# EAGLE design Enclosure 100x68 PBC-X (EAGLE 9.6.1)
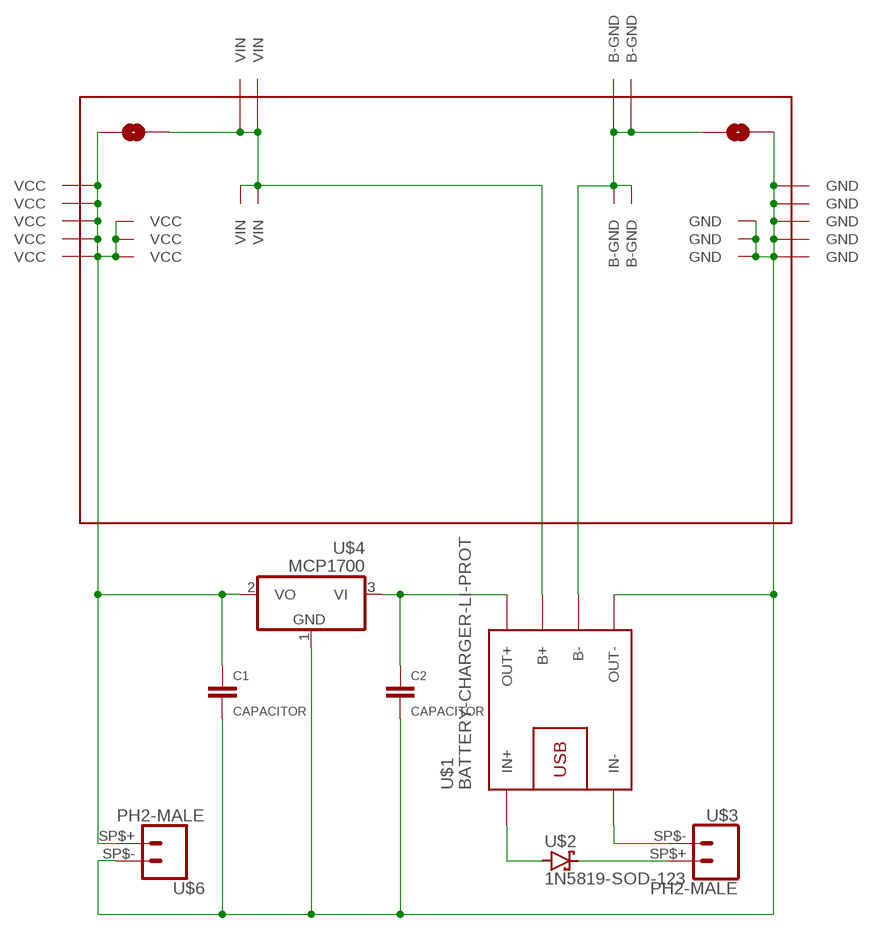
[diagram p0: schematic, sheet 1]

## Parts
C1  CAPACITOR  [C0805]
C2  CAPACITOR  [C0805]
U$1  BATTERY-CHARGER-LI-PROT  [BATTERY-CHARGER-LI-PROT]
U$2  1N5819-SOD-123  [SOD-123]
U$3  PH2-MALE  [PH2]
U$4  MCP1700  [SOT23]
U$5  PROTO-34X22-BAT-SJ-CHG  [PROTO-34X22-BAT-SJ-CHG]
U$6  PH2-MALE  [PH2]

## Nets
GND: C1.2 C2.2 U$1.OUT- U$4.1(GND) U$5.GND U$5.P33-13(GND) U$5.P33-14(GND) U$5.P33-15(GND) U$5.P34-13(GND) U$5.P34-14(GND) U$5.P34-15(GND) U$5.P34-16(GND) U$5.P34-17(GND) U$6.SP$-
N$1: U$2.2(C) U$3.SP$+
N$2: U$1.IN- U$3.SP$-
N$3: U$1.B+ U$5.P02-17(VIN) U$5.P03-16(VIN) U$5.P05-19(VIN) U$5.P06-19(VIN) U$5.VIN
N$4: U$1.B- U$5.B-GND U$5.P28-19(B-GND) U$5.P30-19(B-GND) U$5.P32-16(B-GND) U$5.P33-17(B-GND)
N$5: U$1.IN+ U$2.1(A)
N$6: C2.1 U$1.OUT+ U$4.3(VI)
VCC: C1.1 U$4.2(VO) U$5.P01-13(VCC) U$5.P01-14(VCC) U$5.P01-15(VCC) U$5.P01-16(VCC) U$5.P01-17(VCC) U$5.P02-13(VCC) U$5.P02-14(VCC) U$5.P02-15(VCC) U$5.VCC U$6.SP$+

## Library data of the parts
C1 C2 = digitalconcepts:CAPACITOR: 0805 Capacitor
U$1 = digitalconcepts:BATTERY-CHARGER-LI-PROT: TP4056 Li Battery Charger module with PCB (rather than module) footprint
U$2 = digitalconcepts:1N5819-SOD-123: 1N5819 Schottky Diode SOD-123
U$3 U$6 = digitalconcepts:PH2-MALE: PH2 Male PCB Connector
U$4 = digitalconcepts:MCP1700: MCP1700 Low Quiescent Current LDO Voltage Regulator
U$5 = digitalconcepts:PROTO-34X22-BAT-SJ-CHG: 34 x 22 Prototyping board, with battery connection (GND + Vcc plane) and space for charging module, voltage regulator and solar panel connection, to fit a 100 x 68 enclosure

## Board
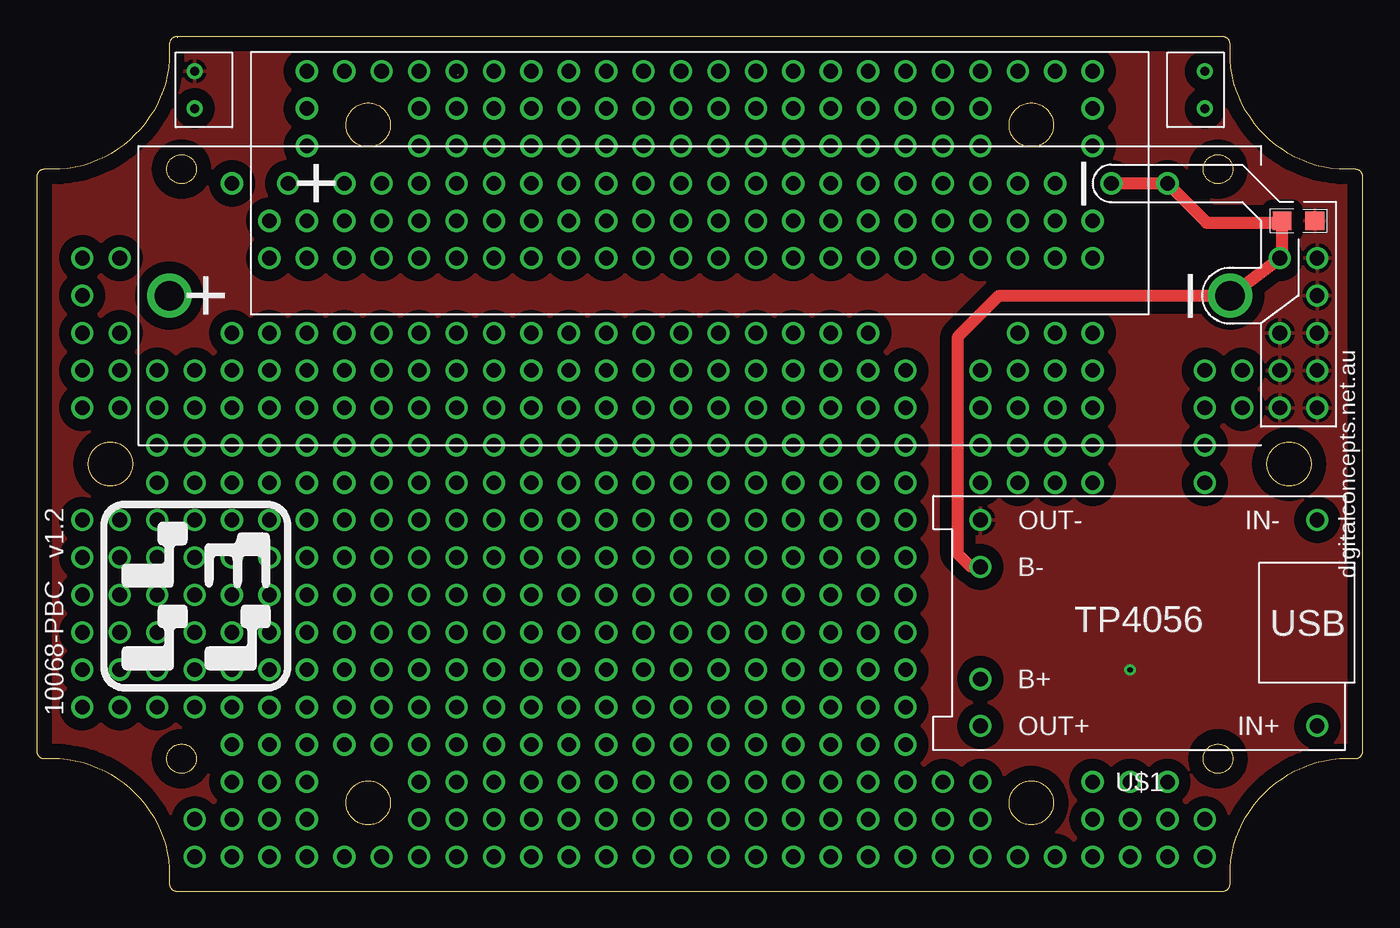
[diagram p1: board, top side]
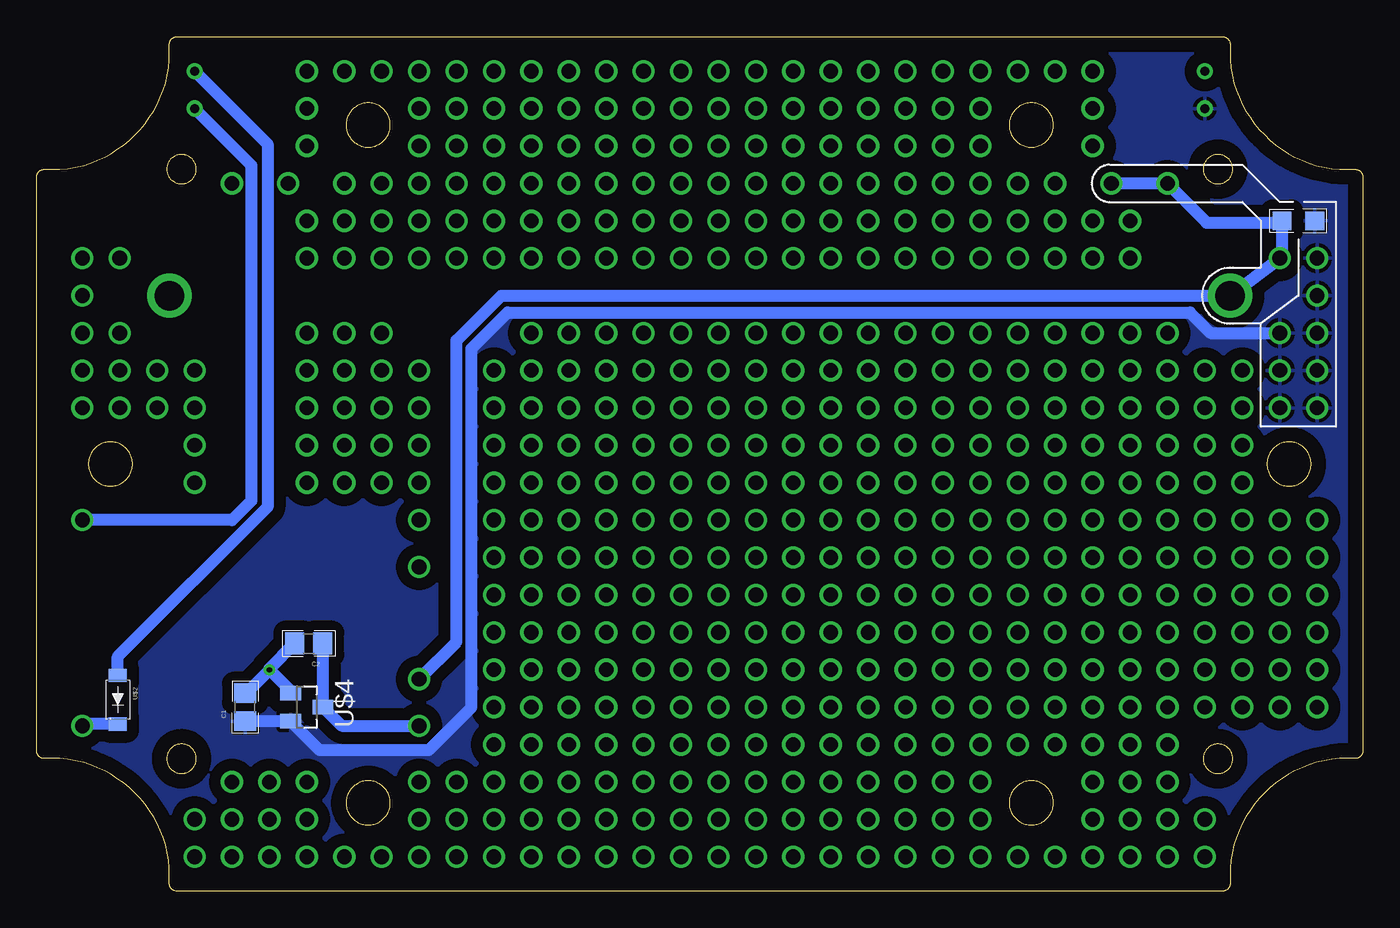
[diagram p2: board, bottom side, seen from below]

Size 90 x 58 mm. Coordinates in mm from the lower left corner, seen from the top.
Outline: 9.4,57.99 9.37,57.98 9.34,57.97 9.31,57.96 9.28,57.95 9.25,57.93 9.22,57.91 9.19,57.9 9.17,57.88 9.15,57.85 9.12,57.83 9.1,57.81 9.09,57.78 9.07,57.75 9.05,57.72 9.03,57.66 9.02,57.63 9.01,57.6 9,57.57 9,57.53 9,56.45 8.94,55.91 8.84,55.39 8.73,54.87 8.57,54.36 8.37,53.89 8.17,53.41 7.92,52.95 7.63,52.53 7.35,52.1 7.02,51.7 6.66,51.34 6.29,50.98 5.9,50.65 5.47,50.37 5.05,50.08 4.59,49.83 4.11,49.63 3.64,49.43 3.13,49.27 2.61,49.16 2.09,49.06 1.55,49 0.46,49 0.43,49 0.4,48.99 0.37,48.98 0.33,48.97 0.3,48.96 0.27,48.95 0.25,48.93 0.22,48.91 0.19,48.9 0.17,48.88 0.15,48.85 0.12,48.83 0.1,48.81 0.08,48.78 0.07,48.75 0.05,48.72 0.04,48.69 0.03,48.66 0.02,48.63 0.01,48.6 0,48.57 0,48.53 0,9.46 0,9.43 0.01,9.4 0.02,9.37 0.03,9.33 0.04,9.3 0.05,9.28 0.07,9.25 0.08,9.22 0.1,9.19 0.12,9.17 0.17,9.12 0.19,9.1 0.22,9.09 0.25,9.07 0.27,9.05 0.3,9.04 0.33,9.03 0.37,9.02 0.4,9.01 0.43,9 0.46,9 1.55,9 2.09,8.94 2.61,8.84 3.13,8.73 3.64,8.57 4.11,8.37 4.59,8.17 5.05,7.92 5.47,7.63 5.9,7.35 6.29,7.02 6.66,6.66 7.02,6.29 7.35,5.9 7.63,5.47 7.92,5.05 8.17,4.59 8.37,4.11 8.57,3.64 8.73,3.13 8.84,2.61 8.94,2.09 9,1.55 9,0.46 9,0.43 9.01,0.4 9.02,0.37 9.03,0.33 9.04,0.31 9.05,0.28 9.07,0.25 9.09,0.22 9.1,0.19 9.12,0.17 9.15,0.15 9.17,0.12 9.19,0.1 9.25,0.07 9.28,0.05 9.31,0.04 9.34,0.03 9.37,0.02 9.4,0.01 9.43,0 9.47,0 80.53,0 80.57,0 80.63,0.02 80.66,0.03 80.69,0.04 80.72,0.05 80.75,0.07 80.78,0.08 80.81,0.1 80.83,0.12 80.85,0.15 80.88,0.17 80.9,0.19 80.91,0.22 80.93,0.25 80.95,0.28 80.96,0.31 80.97,0.33 80.98,0.37 80.99,0.4 81,0.43 81,0.47 81,1.55 81.06,2.09 81.16,2.61 81.27,3.13 81.43,3.64 81.63,4.11 81.83,4.59 82.08,5.05 82.37,5.47 82.65,5.9 82.98,6.3 83.34,6.66 83.7,7.02 84.1,7.35 84.53,7.63 84.95,7.92 85.41,8.17 85.89,8.37 86.36,8.57 86.87,8.73 87.39,8.84 87.91,8.94 88.45,9 89.53,9 89.57,9 89.6,9.01 89.63,9.02 89.66,9.03 89.69,9.04 89.72,9.05 89.75,9.07 89.78,9.09 89.81,9.1 89.83,9.12 89.85,9.15 89.88,9.17 89.9,9.19 89.91,9.22 89.93,9.25 89.95,9.28 89.96,9.31 89.97,9.34 89.98,9.37 89.99,9.4 90,9.43 90,9.47 90,48.53 90,48.57 89.99,48.6 89.98,48.63 89.97,48.66 89.96,48.69 89.95,48.72 89.93,48.75 89.91,48.78 89.9,48.81 89.88,48.83 89.85,48.85 89.83,48.88 89.81,48.9 89.78,48.91 89.75,48.93 89.72,48.95 89.69,48.96 89.66,48.97 89.63,48.98 89.6,48.99 89.57,49 89.53,49 88.45,49 87.91,49.06 87.39,49.16 86.87,49.27 86.36,49.43 85.89,49.63 85.41,49.83 84.95,50.08 84.53,50.37 84.1,50.65 83.7,50.98 82.98,51.7 82.65,52.1 82.37,52.53 82.08,52.95 81.83,53.41 81.63,53.89 81.43,54.36 81.27,54.87 81.16,55.39 81.06,55.91 81,56.45 81,57.53 81,57.57 80.99,57.6 80.98,57.63 80.97,57.66 80.96,57.69 80.95,57.72 80.93,57.75 80.91,57.78 80.9,57.81 80.88,57.83 80.85,57.85 80.83,57.88 80.81,57.9 80.78,57.91 80.75,57.93 80.72,57.95 80.69,57.96 80.66,57.97 80.63,57.98 80.6,57.99 80.57,58 80.53,58 9.47,58 9.43,58 9.4,57.99
Outline: 67.81,7.46 67.9,7.44 68,7.41 68.09,7.37 68.18,7.33 68.26,7.28 68.34,7.23 68.42,7.18 68.5,7.12 68.56,7.05 68.63,6.98 68.69,6.91 68.75,6.83 68.8,6.75 68.85,6.66 68.89,6.57 68.92,6.48 68.95,6.39 68.97,6.29 68.99,6.19 69,6.09 69,5.88 68.99,5.78 68.97,5.69 68.95,5.59 68.92,5.49 68.89,5.4 68.85,5.31 68.8,5.23 68.75,5.15 68.69,5.07 68.63,4.99 68.56,4.93 68.5,4.86 68.42,4.8 68.34,4.74 68.26,4.69 68.18,4.64 68.09,4.61 68,4.57 67.9,4.54 67.81,4.52 67.71,4.5 67.61,4.49 67.4,4.49 67.3,4.5 67.2,4.52 67.1,4.54 67.01,4.57 66.92,4.61 66.83,4.64 66.74,4.69 66.59,4.8 66.51,4.86 66.44,4.93 66.37,4.99 66.31,5.07 66.26,5.15 66.21,5.23 66.16,5.31 66.12,5.4 66.08,5.49 66.05,5.59 66.03,5.69 66.01,5.78 66,5.88 66,6.09 66.01,6.19 66.05,6.39 66.08,6.48 66.12,6.57 66.16,6.66 66.21,6.75 66.26,6.83 66.31,6.91 66.37,6.98 66.44,7.05 66.51,7.12 66.59,7.18 66.67,7.23 66.74,7.28 66.83,7.33 66.92,7.37 67.01,7.41 67.1,7.44 67.2,7.46 67.3,7.48 67.4,7.49 67.61,7.49 67.71,7.48 67.81,7.46
Outline: 22.8,7.46 22.89,7.44 22.99,7.41 23.08,7.37 23.17,7.33 23.25,7.28 23.33,7.23 23.41,7.18 23.49,7.12 23.56,7.05 23.62,6.98 23.68,6.91 23.74,6.83 23.79,6.75 23.84,6.66 23.88,6.57 23.92,6.48 23.94,6.39 23.96,6.29 23.98,6.19 24,6.09 24,5.88 23.98,5.78 23.96,5.69 23.94,5.59 23.92,5.49 23.88,5.4 23.84,5.31 23.79,5.23 23.74,5.15 23.68,5.07 23.62,4.99 23.56,4.93 23.49,4.86 23.41,4.8 23.25,4.69 23.17,4.64 23.08,4.61 22.99,4.57 22.89,4.54 22.8,4.52 22.7,4.5 22.6,4.49 22.39,4.49 22.29,4.5 22.19,4.52 22.1,4.54 22,4.57 21.91,4.61 21.82,4.64 21.74,4.69 21.66,4.74 21.58,4.8 21.5,4.86 21.43,4.93 21.37,4.99 21.3,5.07 21.25,5.15 21.2,5.23 21.15,5.31 21.11,5.4 21.07,5.49 21.05,5.59 21.02,5.69 21.01,5.78 20.99,5.88 20.99,6.09 21.01,6.19 21.02,6.29 21.05,6.39 21.07,6.48 21.11,6.57 21.15,6.66 21.2,6.75 21.25,6.83 21.3,6.91 21.37,6.98 21.43,7.05 21.5,7.12 21.58,7.18 21.66,7.23 21.74,7.28 21.82,7.33 21.91,7.37 22,7.41 22.1,7.44 22.19,7.46 22.29,7.48 22.39,7.49 22.6,7.49 22.7,7.48 22.8,7.46
Outline: 80.38,9.96 80.44,9.95 80.51,9.93 80.57,9.91 80.63,9.88 80.68,9.85 80.74,9.81 80.79,9.78 80.84,9.74 80.89,9.69 80.93,9.65 80.97,9.6 81.01,9.54 81.04,9.49 81.07,9.43 81.1,9.37 81.13,9.31 81.14,9.25 81.16,9.19 81.17,9.12 81.18,9.05 81.18,8.92 81.17,8.85 81.16,8.78 81.14,8.72 81.13,8.66 81.1,8.6 81.07,8.54 81.04,8.48 81.01,8.43 80.97,8.37 80.93,8.32 80.89,8.28 80.84,8.23 80.79,8.19 80.74,8.16 80.68,8.12 80.63,8.09 80.57,8.06 80.51,8.04 80.44,8.02 80.38,8 80.31,7.99 80.25,7.98 80.11,7.98 80.04,7.99 79.98,8 79.91,8.02 79.85,8.04 79.79,8.06 79.73,8.09 79.67,8.12 79.62,8.16 79.57,8.19 79.52,8.23 79.47,8.28 79.43,8.32 79.38,8.37 79.35,8.43 79.31,8.48 79.28,8.54 79.26,8.6 79.23,8.66 79.21,8.72 79.2,8.78 79.19,8.85 79.18,8.92 79.18,9.05 79.19,9.12 79.2,9.19 79.21,9.25 79.23,9.31 79.26,9.37 79.28,9.43 79.31,9.49 79.35,9.54 79.38,9.6 79.43,9.65 79.47,9.69 79.52,9.74 79.57,9.78 79.62,9.81 79.67,9.85 79.73,9.88 79.79,9.91 79.85,9.93 79.91,9.95 79.98,9.96 80.04,9.98 80.11,9.98 80.25,9.98 80.31,9.98 80.38,9.96
Outline: 10.02,9.96 10.09,9.95 10.15,9.93 10.21,9.91 10.27,9.88 10.33,9.85 10.38,9.81 10.43,9.78 10.48,9.74 10.53,9.69 10.57,9.65 10.61,9.6 10.65,9.54 10.69,9.49 10.72,9.43 10.74,9.37 10.77,9.31 10.79,9.25 10.8,9.19 10.81,9.12 10.82,9.05 10.82,8.92 10.81,8.85 10.8,8.78 10.79,8.72 10.77,8.66 10.74,8.6 10.72,8.54 10.69,8.48 10.65,8.43 10.61,8.37 10.57,8.32 10.53,8.28 10.48,8.23 10.43,8.19 10.38,8.16 10.33,8.12 10.27,8.09 10.21,8.06 10.15,8.04 10.09,8.02 10.02,8 9.96,7.99 9.89,7.98 9.75,7.98 9.68,7.99 9.62,8 9.55,8.02 9.49,8.04 9.43,8.06 9.37,8.09 9.31,8.12 9.26,8.16 9.21,8.19 9.16,8.23 9.11,8.28 9.07,8.32 9.03,8.37 8.99,8.43 8.96,8.48 8.92,8.54 8.9,8.6 8.87,8.66 8.85,8.72 8.84,8.78 8.83,8.85 8.82,8.92 8.82,9.05 8.83,9.12 8.84,9.19 8.85,9.25 8.87,9.31 8.9,9.37 8.92,9.43 8.96,9.49 8.99,9.54 9.03,9.6 9.07,9.65 9.11,9.69 9.16,9.74 9.21,9.78 9.26,9.81 9.31,9.85 9.37,9.88 9.43,9.91 9.49,9.93 9.55,9.95 9.62,9.96 9.68,9.98 9.75,9.98 9.89,9.98 9.96,9.98 10.02,9.96
Outline: 85.31,30.47 85.4,30.45 85.5,30.42 85.59,30.38 85.68,30.34 85.76,30.3 85.84,30.24 85.92,30.19 86,30.13 86.06,30.06 86.13,29.99 86.19,29.92 86.25,29.84 86.3,29.76 86.35,29.67 86.39,29.58 86.42,29.49 86.45,29.4 86.47,29.3 86.49,29.2 86.5,29.1 86.5,28.9 86.49,28.8 86.47,28.7 86.45,28.6 86.42,28.51 86.39,28.42 86.35,28.33 86.3,28.24 86.25,28.16 86.19,28.08 86.13,28.01 86.06,27.94 86,27.87 85.92,27.81 85.84,27.76 85.76,27.7 85.68,27.66 85.59,27.62 85.5,27.58 85.4,27.55 85.31,27.53 85.21,27.51 85.11,27.5 84.9,27.5 84.8,27.51 84.7,27.53 84.6,27.55 84.51,27.58 84.42,27.62 84.33,27.66 84.25,27.7 84.17,27.76 84.09,27.81 84.01,27.87 83.94,27.94 83.88,28.01 83.81,28.08 83.76,28.16 83.71,28.24 83.66,28.33 83.62,28.42 83.58,28.51 83.55,28.6 83.54,28.7 83.52,28.8 83.5,28.9 83.5,29.1 83.52,29.2 83.54,29.3 83.55,29.4 83.58,29.49 83.62,29.58 83.66,29.67 83.71,29.76 83.76,29.84 83.81,29.92 83.88,29.99 83.94,30.06 84.01,30.13 84.09,30.19 84.17,30.24 84.25,30.3 84.33,30.34 84.42,30.38 84.51,30.42 84.6,30.45 84.7,30.47 84.8,30.49 84.9,30.5 85.11,30.5 85.21,30.49 85.31,30.47
Outline: 5.3,30.47 5.39,30.45 5.49,30.42 5.67,30.34 5.75,30.3 5.83,30.24 5.91,30.19 5.99,30.13 6.06,30.06 6.12,29.99 6.18,29.92 6.24,29.84 6.29,29.76 6.34,29.67 6.41,29.49 6.44,29.4 6.46,29.3 6.48,29.2 6.49,29.1 6.49,28.9 6.48,28.8 6.46,28.7 6.44,28.6 6.41,28.51 6.38,28.42 6.34,28.33 6.29,28.24 6.24,28.16 6.18,28.08 6.12,28.01 6.06,27.94 5.99,27.87 5.91,27.81 5.83,27.76 5.75,27.7 5.67,27.66 5.58,27.62 5.49,27.58 5.39,27.55 5.3,27.53 5.2,27.51 5.1,27.5 4.89,27.5 4.79,27.51 4.69,27.53 4.59,27.55 4.5,27.58 4.41,27.62 4.32,27.66 4.24,27.7 4.16,27.76 4.08,27.81 4,27.87 3.93,27.94 3.87,28.01 3.8,28.08 3.75,28.16 3.7,28.24 3.65,28.33 3.61,28.42 3.57,28.51 3.54,28.6 3.52,28.7 3.5,28.8 3.49,28.9 3.49,29.1 3.5,29.2 3.52,29.3 3.54,29.4 3.57,29.49 3.61,29.58 3.65,29.67 3.7,29.76 3.75,29.84 3.8,29.92 3.87,29.99 3.93,30.06 4,30.13 4.08,30.19 4.16,30.24 4.24,30.3 4.32,30.34 4.5,30.42 4.59,30.45 4.69,30.47 4.79,30.49 4.89,30.5 5.1,30.5 5.2,30.49 5.3,30.47
Outline: 80.38,49.99 80.44,49.98 80.51,49.96 80.57,49.94 80.63,49.91 80.68,49.88 80.74,49.84 80.79,49.81 80.84,49.77 80.93,49.68 80.97,49.63 81.01,49.57 81.04,49.52 81.07,49.46 81.1,49.4 81.13,49.34 81.14,49.28 81.16,49.22 81.17,49.15 81.18,49.08 81.18,48.95 81.17,48.88 81.16,48.81 81.14,48.75 81.13,48.69 81.1,48.63 81.07,48.57 81.04,48.51 81.01,48.46 80.97,48.4 80.93,48.35 80.84,48.26 80.79,48.22 80.74,48.19 80.68,48.15 80.63,48.12 80.57,48.09 80.51,48.07 80.44,48.05 80.38,48.03 80.31,48.02 80.25,48.01 80.11,48.01 80.04,48.02 79.98,48.03 79.91,48.05 79.85,48.07 79.79,48.09 79.73,48.12 79.67,48.15 79.62,48.19 79.57,48.22 79.52,48.26 79.43,48.35 79.38,48.4 79.35,48.46 79.31,48.51 79.28,48.57 79.26,48.63 79.23,48.69 79.21,48.75 79.2,48.81 79.19,48.88 79.18,48.95 79.18,49.08 79.19,49.15 79.2,49.22 79.21,49.28 79.23,49.34 79.26,49.4 79.28,49.46 79.31,49.52 79.35,49.57 79.38,49.63 79.43,49.68 79.52,49.77 79.57,49.81 79.62,49.84 79.67,49.88 79.73,49.91 79.79,49.94 79.85,49.96 79.91,49.98 79.98,49.99 80.04,50.01 80.11,50.01 80.25,50.01 80.31,50.01 80.38,49.99
Outline: 10.02,49.99 10.09,49.98 10.15,49.96 10.21,49.94 10.27,49.91 10.33,49.88 10.38,49.84 10.43,49.81 10.48,49.77 10.53,49.72 10.57,49.68 10.61,49.63 10.65,49.57 10.69,49.52 10.72,49.46 10.74,49.4 10.77,49.34 10.79,49.28 10.8,49.22 10.81,49.15 10.82,49.08 10.82,48.95 10.81,48.88 10.8,48.81 10.79,48.75 10.77,48.69 10.74,48.63 10.72,48.57 10.69,48.51 10.65,48.46 10.61,48.4 10.57,48.35 10.53,48.31 10.48,48.26 10.43,48.22 10.38,48.19 10.33,48.15 10.27,48.12 10.21,48.09 10.15,48.07 10.09,48.05 10.02,48.03 9.96,48.02 9.89,48.01 9.75,48.01 9.68,48.02 9.62,48.03 9.55,48.05 9.49,48.07 9.43,48.09 9.37,48.12 9.31,48.15 9.26,48.19 9.21,48.22 9.16,48.26 9.11,48.31 9.07,48.35 9.03,48.4 8.99,48.46 8.96,48.51 8.92,48.57 8.9,48.63 8.87,48.69 8.85,48.75 8.84,48.81 8.83,48.88 8.82,48.95 8.82,49.08 8.83,49.15 8.84,49.22 8.85,49.28 8.87,49.34 8.9,49.4 8.92,49.46 8.96,49.52 8.99,49.57 9.03,49.63 9.07,49.68 9.11,49.72 9.16,49.77 9.21,49.81 9.26,49.84 9.31,49.88 9.37,49.91 9.43,49.94 9.49,49.96 9.55,49.98 9.62,49.99 9.68,50.01 9.75,50.01 9.89,50.01 9.96,50.01 10.02,49.99
Outline: 22.19,50.54 22.1,50.56 22,50.59 21.91,50.63 21.82,50.67 21.74,50.71 21.66,50.77 21.58,50.82 21.5,50.88 21.43,50.95 21.37,51.02 21.31,51.09 21.25,51.17 21.2,51.25 21.15,51.34 21.11,51.43 21.07,51.52 21.05,51.61 21.03,51.71 21.01,51.81 21,51.91 21,52.12 21.01,52.22 21.03,52.31 21.05,52.41 21.07,52.51 21.11,52.6 21.15,52.69 21.2,52.77 21.25,52.85 21.31,52.93 21.37,53.01 21.43,53.07 21.5,53.14 21.58,53.2 21.66,53.26 21.74,53.31 21.82,53.36 21.91,53.39 22,53.43 22.1,53.46 22.19,53.48 22.29,53.5 22.39,53.51 22.6,53.51 22.7,53.5 22.8,53.48 22.89,53.46 22.99,53.43 23.08,53.39 23.17,53.36 23.25,53.31 23.33,53.26 23.41,53.2 23.49,53.14 23.56,53.07 23.62,53.01 23.68,52.93 23.74,52.85 23.79,52.77 23.84,52.69 23.88,52.6 23.91,52.51 23.94,52.41 23.96,52.31 23.98,52.22 24,52.12 24,51.91 23.98,51.81 23.96,51.71 23.94,51.61 23.91,51.52 23.88,51.43 23.84,51.34 23.79,51.25 23.74,51.17 23.68,51.09 23.62,51.02 23.56,50.95 23.49,50.88 23.41,50.82 23.33,50.77 23.25,50.71 23.17,50.67 23.08,50.63 22.99,50.59 22.89,50.56 22.8,50.54 22.7,50.52 22.6,50.51 22.39,50.51 22.29,50.52 22.19,50.54
Outline: 68.75,52.85 68.8,52.77 68.85,52.69 68.89,52.6 68.92,52.51 68.95,52.41 68.97,52.31 68.99,52.22 69,52.12 69,51.91 68.99,51.81 68.97,51.71 68.95,51.61 68.92,51.52 68.89,51.43 68.85,51.34 68.8,51.25 68.75,51.17 68.69,51.09 68.63,51.02 68.5,50.88 68.42,50.82 68.34,50.77 68.26,50.71 68.18,50.67 68.09,50.63 68,50.59 67.9,50.56 67.81,50.54 67.71,50.52 67.61,50.51 67.4,50.51 67.3,50.52 67.2,50.54 67.1,50.56 67.01,50.59 66.92,50.63 66.83,50.67 66.75,50.71 66.67,50.77 66.59,50.82 66.51,50.88 66.44,50.95 66.37,51.02 66.31,51.09 66.26,51.17 66.21,51.25 66.16,51.34 66.12,51.43 66.08,51.52 66.05,51.61 66.03,51.71 66.01,51.81 66,51.91 66,52.12 66.01,52.22 66.03,52.31 66.05,52.41 66.08,52.51 66.12,52.6 66.16,52.69 66.21,52.77 66.26,52.85 66.31,52.93 66.37,53.01 66.44,53.07 66.51,53.14 66.59,53.2 66.67,53.26 66.75,53.31 66.83,53.36 66.92,53.39 67.01,53.43 67.1,53.46 67.2,53.48 67.3,53.5 67.4,53.51 67.61,53.51 67.71,53.5 67.81,53.48 67.9,53.46 68,53.43 68.09,53.39 68.18,53.36 68.26,53.31 68.34,53.26 68.42,53.2 68.5,53.14 68.63,53.01 68.69,52.93 68.75,52.85
Copper layers (1*16): Top 0.035mm / dielectric 1.5mm / Bottom 0.035mm
Design rules "default": minimum track width 6mil, minimum drill 0.35mm, track to track 6mil, track to pad 6mil, pad to pad 6mil, via to via 6mil, smd to smd 6mil, copper to edge 40mil, drill to drill 6mil, minimum pad ring 10mil, minimum via ring 8mil, stop-mask expansion 4mil, vias tented up to drill 0mil, thermal gap 10mil

### Footprints (pad centres in the part's own frame; a part is rotated, then mirrored left to right if it is on the bottom)
C0805 = smd 1.3 x 1.5: 1 -0.95,0; 2 0.95,0
BATTERY-CHARGER-LI-PROT = drill 1: B+ 10.795,3.81; B- 10.795,-3.81; IN+ -12.065,6.985; IN- -12.065,-6.985; OUT+ 10.795,6.985; OUT- 10.795,-6.985
SOD-123 = smd 0.91 x 1.22: 1 1.65,0; 2 -1.65,0
PH2 = drill 0.6: SP$+ -1.27,0; SP$- 1.27,0
SOT23 = smd 1 x 1.4: 1 -0.95,-1.1; 2 0.95,-1.1; 3 0,1.1
PROTO-34X22-BAT-SJ-CHG = smd 1.27 x 1.27: B-GND 39.534,16.51; GND 41.746,16.51 | drill 1: P01-05 -41.91,-16.51; P01-06 -41.91,-13.97; P01-07 -41.91,-11.43; P01-08 -41.91,-8.89; P01-09 -41.91,-6.35; P01-10 -41.91,-3.81; P01-13 -41.91,3.81; P01-14 -41.91,6.35; P01-15 -41.91,8.89; P01-16 -41.91,11.43; P01-17 -41.91,13.97; P02-05 -39.37,-16.51; P02-06 -39.37,-13.97; P02-07 -39.37,-11.43; P02-08 -39.37,-8.89; P02-09 -39.37,-6.35; P02-10 -39.37,-3.81; P02-13 -39.37,3.81; P02-14 -39.37,6.35; P02-15 -39.37,8.89; P02-17 -39.37,13.97; P03-05 -36.83,-16.51; P03-06 -36.83,-13.97; P03-07 -36.83,-11.43; P03-08 -36.83,-8.89; P03-09 -36.83,-6.35; P03-10 -36.83,-3.81; P03-11 -36.83,-1.27; P03-12 -36.83,1.27; P03-13 -36.83,3.81; P03-14 -36.83,6.35; P04-01 -34.29,-26.67; P04-02 -34.29,-24.13; P04-05 -34.29,-16.51; P04-06 -34.29,-13.97; P04-07 -34.29,-11.43; P04-08 -34.29,-8.89; P04-09 -34.29,-6.35; P04-10 -34.29,-3.81; P04-11 -34.29,-1.27; P04-12 -34.29,1.27; P04-13 -34.29,3.81; P04-14 -34.29,6.35; P05-01 -31.75,-26.67; P05-02 -31.75,-24.13; P05-03 -31.75,-21.59; P05-04 -31.75,-19.05; P05-05 -31.75,-16.51; P05-06 -31.75,-13.97; P05-07 -31.75,-11.43; P05-08 -31.75,-8.89; P05-09 -31.75,-6.35; P05-10 -31.75,-3.81; P05-11 -31.75,-1.27; P05-12 -31.75,1.27; P05-13 -31.75,3.81; P05-14 -31.75,6.35; P05-15 -31.75,8.89; P05-19 -31.75,19.05; P06-01 -29.21,-26.67; P06-02 -29.21,-24.13; P06-03 -29.21,-21.59; P06-04 -29.21,-19.05; P06-05 -29.21,-16.51; P06-06 -29.21,-13.97; P06-07 -29.21,-11.43; P06-08 -29.21,-8.89; P06-09 -29.21,-6.35; P06-10 -29.21,-3.81; P06-11 -29.21,-1.27; P06-12 -29.21,1.27; P06-13 -29.21,3.81; P06-14 -29.21,6.35; P06-15 -29.21,8.89; P06-17 -29.21,13.97; P06-18 -29.21,16.51; P06-19 -27.94,19.05; P07-01 -26.67,-26.67; P07-02 -26.67,-24.13; P07-03 -26.67,-21.59; P07-04 -26.67,-19.05; P07-05 -26.67,-16.51; P07-06 -26.67,-13.97; P07-07 -26.67,-11.43; P07-08 -26.67,-8.89; P07-09 -26.67,-6.35; P07-10 -26.67,-3.81; P07-11 -26.67,-1.27; P07-12 -26.67,1.27; P07-13 -26.67,3.81; P07-14 -26.67,6.35; P07-15 -26.67,8.89; P07-17 -26.67,13.97; P07-18 -26.67,16.51; P07-20 -26.67,21.59; P07-21 -26.67,24.13; P07-22 -26.67,26.67; P08-01 -24.13,-26.67; P08-04 -24.13,-19.05; P08-05 -24.13,-16.51; P08-06 -24.13,-13.97; P08-07 -24.13,-11.43; P08-08 -24.13,-8.89; P08-09 -24.13,-6.35; P08-10 -24.13,-3.81; P08-11 -24.13,-1.27; P08-12 -24.13,1.27; P08-13 -24.13,3.81; P08-14 -24.13,6.35; P08-15 -24.13,8.89; P08-17 -24.13,13.97; P08-18 -24.13,16.51; P08-19 -24.13,19.05; P08-22 -24.13,26.67; P09-01 -21.59,-26.67; P09-04 -21.59,-19.05; P09-05 -21.59,-16.51; P09-06 -21.59,-13.97; P09-07 -21.59,-11.43; P09-08 -21.59,-8.89; P09-09 -21.59,-6.35; P09-10 -21.59,-3.81; P09-11 -21.59,-1.27; P09-12 -21.59,1.27; P09-13 -21.59,3.81; P09-14 -21.59,6.35; P09-15 -21.59,8.89; P09-17 -21.59,13.97; P09-18 -21.59,16.51; P09-19 -21.59,19.05; P09-22 -21.59,26.67; P10-01 -19.05,-26.67; P10-02 -19.05,-24.13; P10-03 -19.05,-21.59; P10-04 -19.05,-19.05; P10-05 -19.05,-16.51; P10-06 -19.05,-13.97; P10-07 -19.05,-11.43; P10-08 -19.05,-8.89; P10-09 -19.05,-6.35; P10-10 -19.05,-3.81; P10-11 -19.05,-1.27; P10-12 -19.05,1.27; P10-13 -19.05,3.81; P10-14 -19.05,6.35; P10-15 -19.05,8.89; P10-17 -19.05,13.97; P10-18 -19.05,16.51; P10-19 -19.05,19.05; P10-20 -19.05,21.59; P10-21 -19.05,24.13; P10-22 -19.05,26.67; P11-01 -16.51,-26.67; P11-02 -16.51,-24.13; P11-03 -16.51,-21.59; P11-04 -16.51,-19.05; P11-05 -16.51,-16.51; P11-06 -16.51,-13.97; P11-07 -16.51,-11.43; P11-08 -16.51,-8.89; P11-09 -16.51,-6.35; P11-10 -16.51,-3.81; P11-11 -16.51,-1.27; P11-12 -16.51,1.27; P11-13 -16.51,3.81; P11-14 -16.51,6.35; P11-15 -16.51,8.89; P11-17 -16.51,13.97; P11-18 -16.51,16.51; P11-19 -16.51,19.05; P11-20 -16.51,21.59; P11-21 -16.51,24.13; P11-22 -16.51,26.67; P12-01 -13.97,-26.67; P12-02 -13.97,-24.13; P12-03 -13.97,-21.59; P12-04 -13.97,-19.05; P12-05 -13.97,-16.51; P12-06 -13.97,-13.97; P12-07 -13.97,-11.43; P12-08 -13.97,-8.89; P12-09 -13.97,-6.35; P12-10 -13.97,-3.81; P12-11 -13.97,-1.27; P12-12 -13.97,1.27; P12-13 -13.97,3.81; P12-14 -13.97,6.35; P12-15 -13.97,8.89; P12-17 -13.97,13.97; P12-18 -13.97,16.51; P12-19 -13.97,19.05; P12-20 -13.97,21.59; P12-21 -13.97,24.13; P12-22 -13.97,26.67; P13-01 -11.43,-26.67; P13-02 -11.43,-24.13; P13-03 -11.43,-21.59; P13-04 -11.43,-19.05; P13-05 -11.43,-16.51; P13-06 -11.43,-13.97; P13-07 -11.43,-11.43; P13-08 -11.43,-8.89; P13-09 -11.43,-6.35; P13-10 -11.43,-3.81; P13-11 -11.43,-1.27; P13-12 -11.43,1.27; P13-13 -11.43,3.81; P13-14 -11.43,6.35; P13-15 -11.43,8.89; P13-17 -11.43,13.97; P13-18 -11.43,16.51; P13-19 -11.43,19.05; P13-20 -11.43,21.59; P13-21 -11.43,24.13; P13-22 -11.43,26.67; P14-01 -8.89,-26.67; P14-02 -8.89,-24.13; P14-03 -8.89,-21.59; P14-04 -8.89,-19.05; P14-05 -8.89,-16.51; P14-06 -8.89,-13.97; P14-07 -8.89,-11.43; P14-08 -8.89,-8.89; P14-09 -8.89,-6.35; P14-10 -8.89,-3.81; P14-11 -8.89,-1.27; P14-12 -8.89,1.27; P14-13 -8.89,3.81; P14-14 -8.89,6.35; P14-15 -8.89,8.89; P14-17 -8.89,13.97; P14-18 -8.89,16.51; P14-19 -8.89,19.05; P14-20 -8.89,21.59; P14-21 -8.89,24.13; P14-22 -8.89,26.67; P15-01 -6.35,-26.67; P15-02 -6.35,-24.13; P15-03 -6.35,-21.59; P15-04 -6.35,-19.05; P15-05 -6.35,-16.51; P15-06 -6.35,-13.97; P15-07 -6.35,-11.43; P15-08 -6.35,-8.89; P15-09 -6.35,-6.35; P15-10 -6.35,-3.81; P15-11 -6.35,-1.27; P15-12 -6.35,1.27; P15-13 -6.35,3.81; P15-14 -6.35,6.35; P15-15 -6.35,8.89; P15-17 -6.35,13.97; P15-18 -6.35,16.51; P15-19 -6.35,19.05; P15-20 -6.35,21.59; P15-21 -6.35,24.13; P15-22 -6.35,26.67; P16-01 -3.81,-26.67; P16-02 -3.81,-24.13; P16-03 -3.81,-21.59; P16-04 -3.81,-19.05; P16-05 -3.81,-16.51; P16-06 -3.81,-13.97; P16-07 -3.81,-11.43; P16-08 -3.81,-8.89; P16-09 -3.81,-6.35; P16-10 -3.81,-3.81; P16-11 -3.81,-1.27; P16-12 -3.81,1.27; P16-13 -3.81,3.81; P16-14 -3.81,6.35; P16-15 -3.81,8.89; P16-17 -3.81,13.97; P16-18 -3.81,16.51; P16-19 -3.81,19.05; P16-20 -3.81,21.59; P16-21 -3.81,24.13; P16-22 -3.81,26.67; P17-01 -1.27,-26.67; P17-02 -1.27,-24.13; P17-03 -1.27,-21.59; P17-04 -1.27,-19.05; P17-05 -1.27,-16.51; P17-06 -1.27,-13.97; P17-07 -1.27,-11.43; P17-08 -1.27,-8.89; P17-09 -1.27,-6.35; P17-10 -1.27,-3.81; P17-11 -1.27,-1.27; P17-12 -1.27,1.27; P17-13 -1.27,3.81; P17-14 -1.27,6.35; P17-15 -1.27,8.89; P17-17 -1.27,13.97; P17-18 -1.27,16.51; P17-19 -1.27,19.05; P17-20 -1.27,21.59; P17-21 -1.27,24.13; P17-22 -1.27,26.67; P18-01 1.27,-26.67; P18-02 1.27,-24.13; P18-03 1.27,-21.59; P18-04 1.27,-19.05; P18-05 1.27,-16.51; P18-06 1.27,-13.97; P18-07 1.27,-11.43; P18-08 1.27,-8.89; P18-09 1.27,-6.35; P18-10 1.27,-3.81; P18-11 1.27,-1.27; P18-12 1.27,1.27; P18-13 1.27,3.81; P18-14 1.27,6.35; P18-15 1.27,8.89; P18-17 1.27,13.97; P18-18 1.27,16.51; P18-19 1.27,19.05; P18-20 1.27,21.59; P18-21 1.27,24.13; P18-22 1.27,26.67; P19-01 3.81,-26.67; P19-02 3.81,-24.13; P19-03 3.81,-21.59; P19-04 3.81,-19.05; P19-05 3.81,-16.51; P19-06 3.81,-13.97; P19-07 3.81,-11.43; P19-08 3.81,-8.89; P19-09 3.81,-6.35; P19-10 3.81,-3.81; P19-11 3.81,-1.27; P19-12 3.81,1.27; P19-13 3.81,3.81; P19-14 3.81,6.35; P19-15 3.81,8.89; P19-17 3.81,13.97; P19-18 3.81,16.51; P19-19 3.81,19.05; P19-20 3.81,21.59; P19-21 3.81,24.13; P19-22 3.81,26.67; P20-01 6.35,-26.67; P20-02 6.35,-24.13; P20-03 6.35,-21.59; P20-04 6.35,-19.05; P20-05 6.35,-16.51; P20-06 6.35,-13.97; P20-07 6.35,-11.43; P20-08 6.35,-8.89; P20-09 6.35,-6.35; P20-10 6.35,-3.81; P20-11 6.35,-1.27; P20-12 6.35,1.27; P20-13 6.35,3.81; P20-14 6.35,6.35; P20-15 6.35,8.89; P20-17 6.35,13.97; P20-18 6.35,16.51; P20-19 6.35,19.05; P20-20 6.35,21.59; P20-21 6.35,24.13; P20-22 6.35,26.67; P21-01 8.89,-26.67; P21-02 8.89,-24.13; P21-03 8.89,-21.59; P21-04 8.89,-19.05; P21-05 8.89,-16.51; P21-06 8.89,-13.97; P21-07 8.89,-11.43; P21-08 8.89,-8.89; P21-09 8.89,-6.35; P21-10 8.89,-3.81; P21-11 8.89,-1.27; P21-12 8.89,1.27; P21-13 8.89,3.81; P21-14 8.89,6.35; P21-15 8.89,8.89; P21-17 8.89,13.97; P21-18 8.89,16.51; P21-19 8.89,19.05; P21-20 8.89,21.59; P21-21 8.89,24.13; P21-22 8.89,26.67; P22-01 11.43,-26.67; P22-02 11.43,-24.13; P22-03 11.43,-21.59; P22-04 11.43,-19.05; P22-05 11.43,-16.51; P22-06 11.43,-13.97; P22-07 11.43,-11.43; P22-08 11.43,-8.89; P22-09 11.43,-6.35; P22-10 11.43,-3.81; P22-11 11.43,-1.27; P22-12 11.43,1.27; P22-13 11.43,3.81; P22-14 11.43,6.35; P22-15 11.43,8.89; P22-17 11.43,13.97; P22-18 11.43,16.51; P22-19 11.43,19.05; P22-20 11.43,21.59; P22-21 11.43,24.13; P22-22 11.43,26.67; P23-01 13.97,-26.67; P23-02 13.97,-24.13; P23-03 13.97,-21.59; P23-04 13.97,-19.05; P23-05 13.97,-16.51; P23-06 13.97,-13.97; P23-07 13.97,-11.43; P23-08 13.97,-8.89; P23-09 13.97,-6.35; P23-10 13.97,-3.81; P23-11 13.97,-1.27; P23-12 13.97,1.27; P23-13 13.97,3.81; P23-14 13.97,6.35; P23-17 13.97,13.97; P23-18 13.97,16.51; P23-19 13.97,19.05; P23-20 13.97,21.59; P23-21 13.97,24.13; P23-22 13.97,26.67; P24-01 16.51,-26.67; P24-02 16.51,-24.13; P24-03 16.51,-21.59; P24-17 16.51,13.97; P24-18 16.51,16.51; P24-19 16.51,19.05; P24-20 16.51,21.59; P24-21 16.51,24.13; P24-22 16.51,26.67; P25-01 19.05,-26.67; P25-02 19.05,-24.13; P25-03 19.05,-21.59; P25-11 19.05,-1.27; P25-12 19.05,1.27; P25-13 19.05,3.81; P25-14 19.05,6.35; P25-17 19.05,13.97; P25-18 19.05,16.51; P25-19 19.05,19.05; P25-20 19.05,21.59; P25-21 19.05,24.13; P25-22 19.05,26.67; P26-01 21.59,-26.67; P26-11 21.59,-1.27; P26-12 21.59,1.27; P26-13 21.59,3.81; P26-14 21.59,6.35; P26-15 21.59,8.89; P26-17 21.59,13.97; P26-18 21.59,16.51; P26-19 21.59,19.05; P26-22 21.59,26.67; P27-01 24.13,-26.67; P27-11 24.13,-1.27; P27-12 24.13,1.27; P27-13 24.13,3.81; P27-14 24.13,6.35; P27-15 24.13,8.89; P27-17 24.13,13.97; P27-18 24.13,16.51; P27-19 24.13,19.05; P27-22 24.13,26.67; P28-01 26.67,-26.67; P28-02 26.67,-24.13; P28-03 26.67,-21.59; P28-11 26.67,-1.27; P28-12 26.67,1.27; P28-13 26.67,3.81; P28-14 26.67,6.35; P28-15 26.67,8.89; P28-17 26.67,13.97; P28-18 26.67,16.51; P28-19 27.94,19.05; P28-20 26.67,21.59; P28-21 26.67,24.13; P28-22 26.67,26.67; P29-01 29.21,-26.67; P29-02 29.21,-24.13; P29-03 29.21,-21.59; P30-01 31.75,-26.67; P30-02 31.75,-24.13; P30-03 31.75,-21.59; P30-19 31.75,19.05; P31-01 34.29,-26.67; P31-02 34.29,-24.13; P31-11 34.29,-1.27; P31-12 34.29,1.27; P31-13 34.29,3.81; P31-14 34.29,6.35; P32-13 36.83,3.81; P32-14 36.83,6.35; P33-13 39.37,3.81; P33-14 39.37,6.35; P33-15 39.37,8.89; P33-17 39.37,13.97; P34-13 41.91,3.81; P34-14 41.91,6.35; P34-15 41.91,8.89; P34-16 41.91,11.43; P34-17 41.91,13.97 | drill 2: P03-16 -36.005,11.43; P32-16 36.005,11.43 | smd 1.27 x 1.27 bottom: VCC -41.746,16.51; VIN -39.534,16.51

### Placement (x,y rotation side)
C1  75.86,12.49 90 bottom
C2  71.54,16.81 180 bottom
U$1  74.84,18.2 180 top
U$2  84.5,13 270 bottom
U$3  79.29,54.4 270 top
U$4  71.67,12.49 270 bottom
U$5  45,29 0 top
U$6  10.71,54.4 90 top

### Tracks (layer width: path | path; a pad name or v marks a point on that pad's centre or on a via)
GND  (via drill 0.35)
  Top 0.152: U$5.GND 86.91,45.35
  Bottom 0.152: 72.62,13.59 U$4.1
  Bottom 0.406: U$4.1 72.77,13.59 | C1.2 75.8,13.44
  Bottom 0.813: 72.77,13.59 v74.21,15.03 | 75.8,13.44 v74.21,15.03 | v74.21,15.03 74.21,15.09 C2.2
  pour Top (isolate 0.813): -1.48,59.48 -1.48,-1.48 91.61,-1.48 91.61,59.48
N$1
  Bottom 0.813: U$3.SP$+ 74.34,50.72 74.34,26.08 84.5,15.92 U$2.2
N$2
  Bottom 0.813: U$1.IN- 76.75,25.19 75.44,26.5 75.44,49.28 U$3.SP$-
N$3
  Bottom 0.152: U$5.P02-17 5.47,43.13
  Bottom 0.813: U$5.P06-19 U$5.P05-19 10.58,45.38 5.59,45.38 U$5.VIN 5.47,43.13 | U$1.B+ 61.51,16.93 61.51,37.38 58.46,40.43 U$5.P03-16 U$5.P02-17
N$4
  Top 0.152: 84.5,45.47 U$5.B-GND
  Top 0.813: U$5.P28-19 U$5.P30-19 79.42,45.38 84.5,45.38 | U$1.B- 63.41,22.01 62.53,22.9 62.53,37.64 65.32,40.43 U$5.P32-16 U$5.P33-17 84.5,43.1 84.5,45.38 | 84.5,45.47 84.5,45.38
N$5
  Bottom 0.152: 86.78,11.35 U$1.IN+
  Bottom 0.813: U$2.1 86.78,11.35
N$6
  Bottom 0.152: 70.59,12.51 U$4.3
  Bottom 0.813: C2.1 70.59,12.51 | U$4.3 69.3,11.22 U$1.OUT+
VCC
  Bottom 0.813: C1.1 U$4.2 70.8,9.57 63.41,9.57 60.49,12.49 60.49,36.82 58.03,39.29 11.73,39.29 10.33,37.89 U$5.P02-15
  pour Bottom (isolate 0.813): -0.21,58.21 -0.21,-0.21 90.34,-0.21 90.34,58.21

### Text on the board
tPlace: + | – | + | – | digitalconcepts.net.au | 10068-PBC v1.2 | TP4056